# EAGLE schematic PI2GENESIS-HUB_V20170403 (EAGLE 8.2.2)
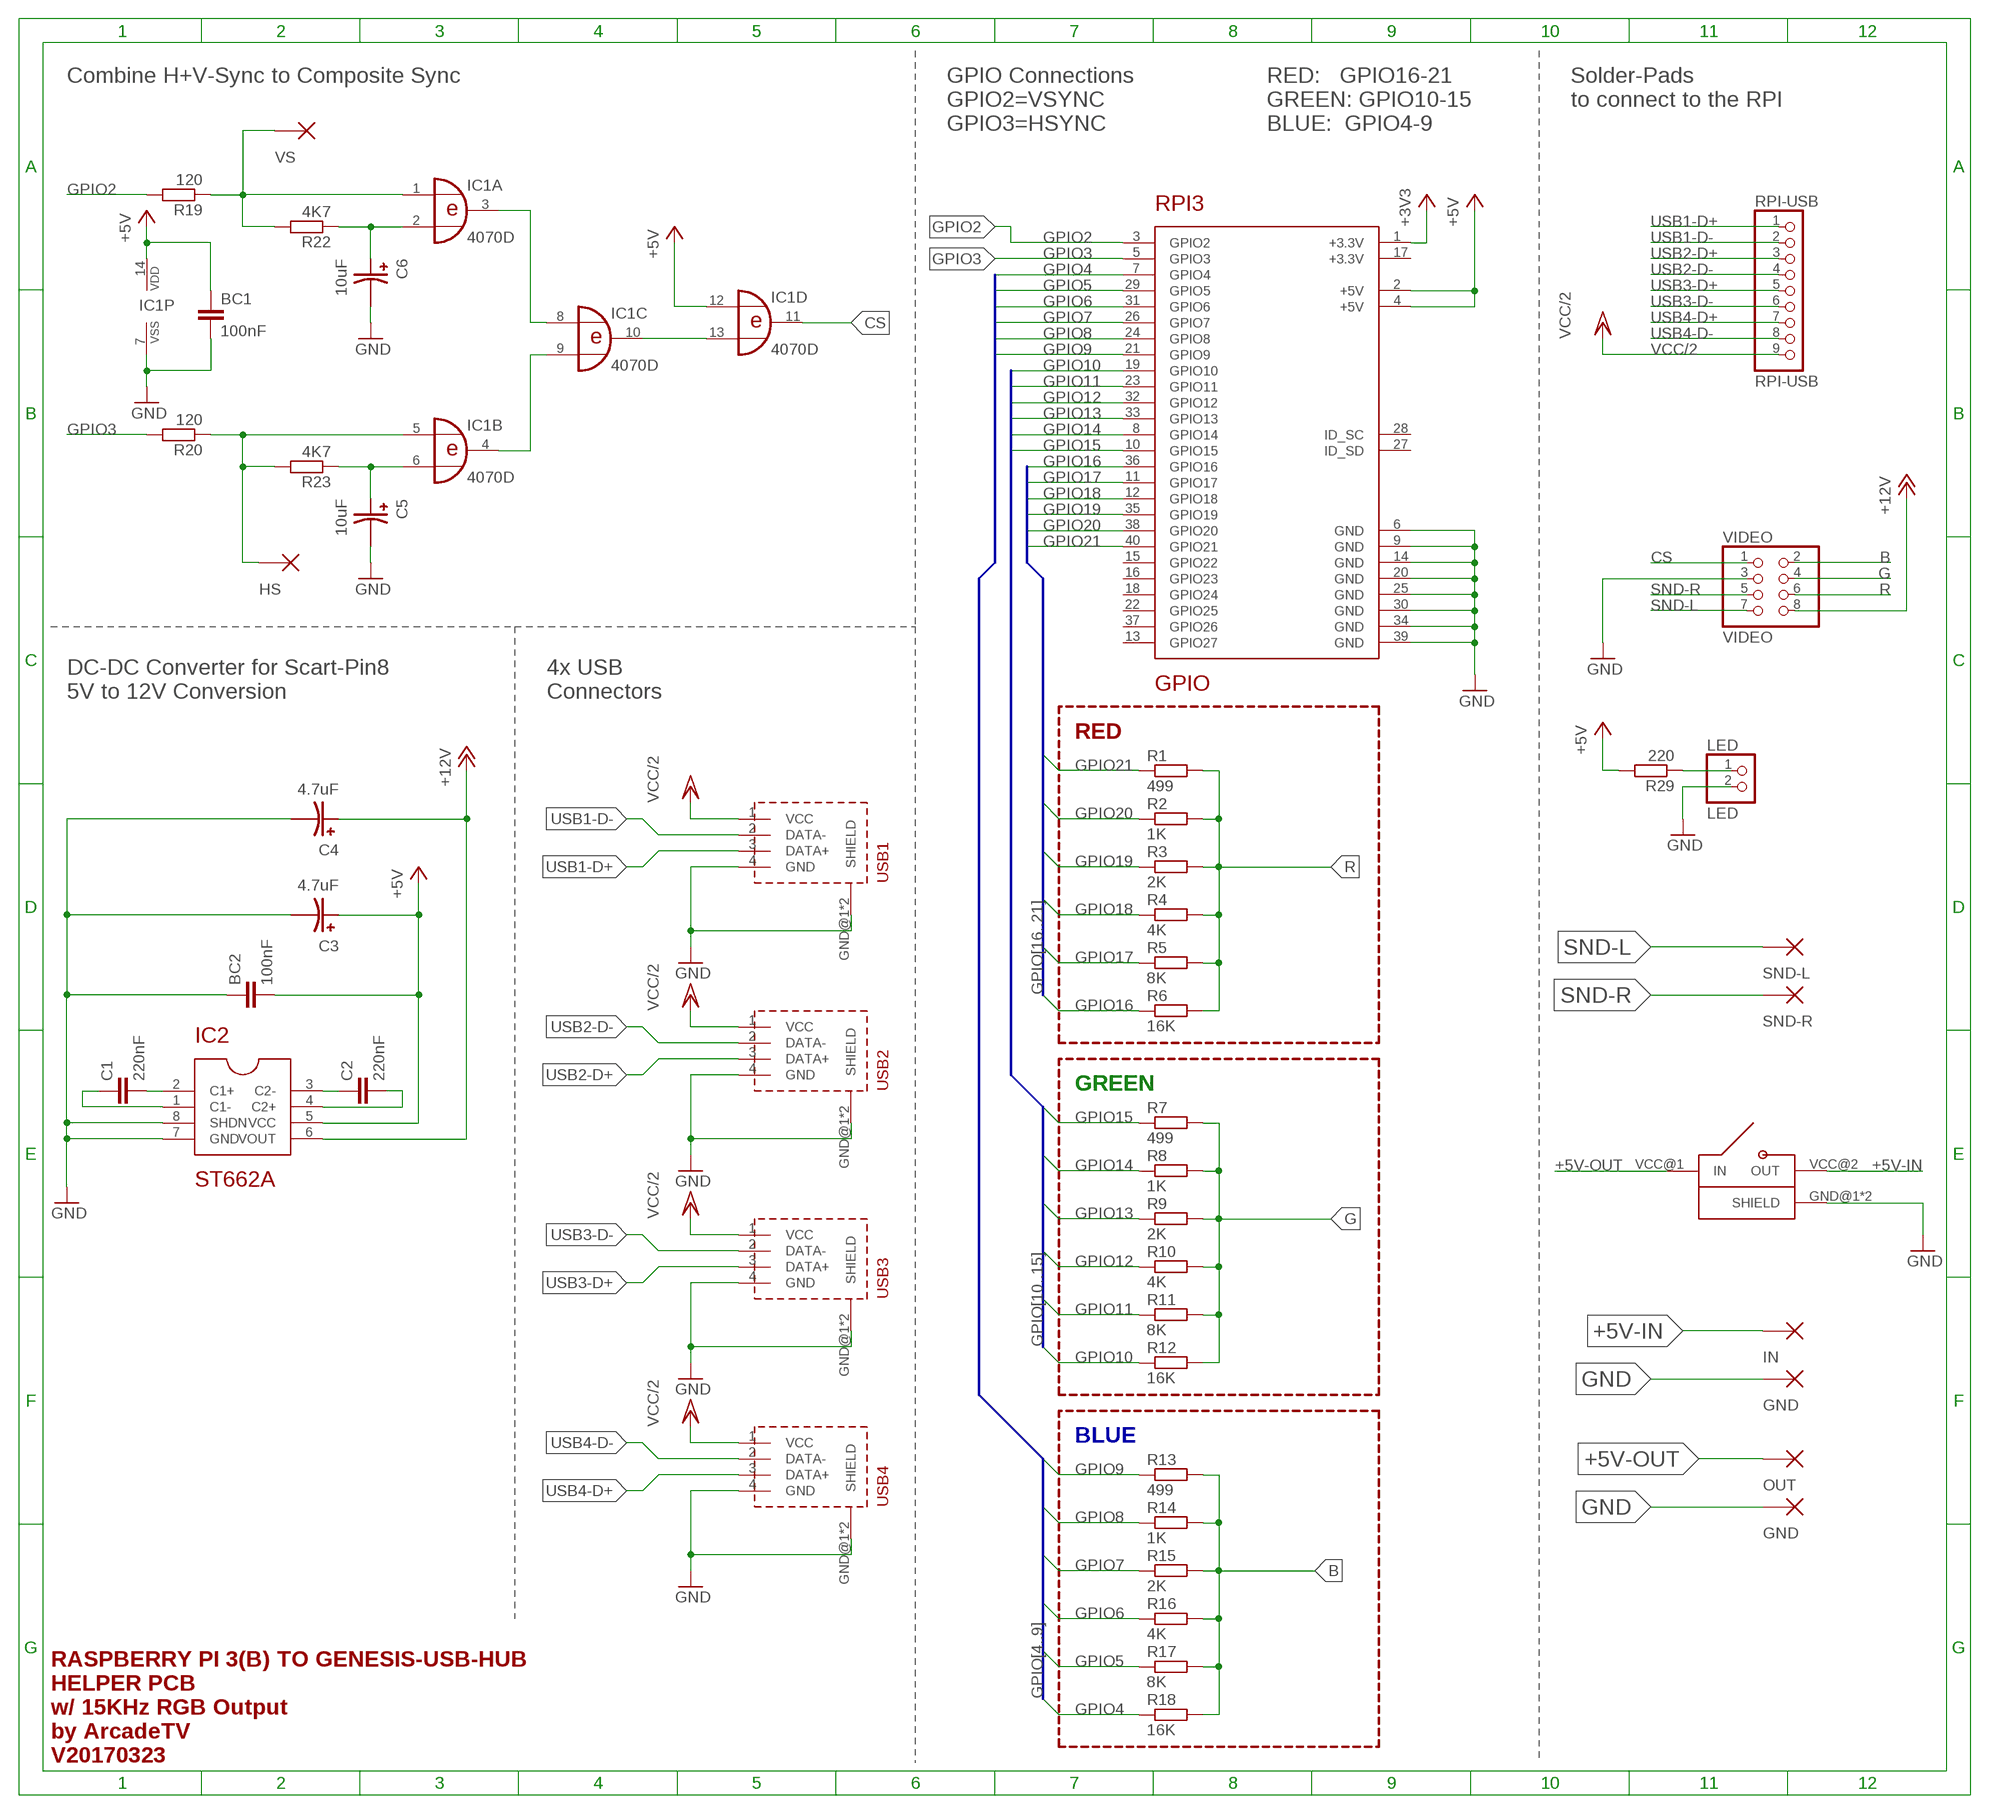
[diagram p0: schematic, sheet 1]

## Parts
BC1  100nF  C0805  [Z0805]
BC2  100nF  C0805  [Z0805]
C1  220nF  C0805  [Z0805]
C2  220nF  C0805  [Z0805]
C3  4.7uF  EEEFPJ101UAR_PANASONIC_VFP-SERIES  [EEEFPJ101UAR_PANASONIC_VFP-SERIES]
C4  4.7uF  EEEFPJ101UAR_PANASONIC_VFP-SERIES  [EEEFPJ101UAR_PANASONIC_VFP-SERIES]
C5  10uF  EEEFPJ101UAR_PANASONIC_VFP-SERIES  [EEEFPJ101UAR_PANASONIC_VFP-SERIES]
C6  10uF  EEEFPJ101UAR_PANASONIC_VFP-SERIES  [EEEFPJ101UAR_PANASONIC_VFP-SERIES]
IC1  4070D  [SO14]
IC2  ST662A  [SO-8]
LED  LED  PINHD-1X2  [1X02]
PAD1  HS  PAD  [PADS]
PAD2  VS  PAD  [PADS]
R1  499  R0805  [Z0805]
R2  1K  R0805  [Z0805]
R3  2K  R0805  [Z0805]
R4  4K  R0805  [Z0805]
R5  8K  R0805  [Z0805]
R6  16K  R0805  [Z0805]
R7  499  R0805  [Z0805]
R8  1K  R0805  [Z0805]
R9  2K  R0805  [Z0805]
R10  4K  R0805  [Z0805]
R11  8K  R0805  [Z0805]
R12  16K  R0805  [Z0805]
R13  499  R0805  [Z0805]
R14  1K  R0805  [Z0805]
R15  2K  R0805  [Z0805]
R16  4K  R0805  [Z0805]
R17  8K  R0805  [Z0805]
R18  16K  R0805  [Z0805]
R19  120  R0805  [Z0805]
R20  120  R0805  [Z0805]
R22  4K7  R0805  [Z0805]
R23  4K7  R0805  [Z0805]
R29  220  R0805  [Z0805]
RPI3  GPIO  RPI3-GPIOSTANDARD  [RPI3-GPIO]
RPI-USB  RPI-USB  PINHD-1X9  [1X09]
U$1  OUT  PAD  [PADS]
U$2  SND-L  PAD  [PADS]
U$3  SND-R  PAD  [PADS]
U$4  ALPS-SSSU011700  [ALPS-SSSU011700]
U$5  IN  PAD  [PADS]
U$6  GND  PAD  [PADS]
U$7  GND  PAD  [PADS]
USB1  USB-GENESIS-HUB  [USB-GENESIS-HUB]
USB2  USB-GENESIS-HUB  [USB-GENESIS-HUB]
USB3  USB-GENESIS-HUB  [USB-GENESIS-HUB]
USB4  USB-GENESIS-HUB  [USB-GENESIS-HUB]
VIDEO  VIDEO  PINHD-2X4  [2X04]

## Nets
+3V3: RPI3.1(+3.3V)
+5V: BC1.1 BC2.2 C3.PLUS(+) IC1.12(D:I0) IC1.14(P:VDD) IC2.5(VCC) R29.2 RPI3.2(+5V) RPI3.4(+5V)
+5V-IN: U$4.VCC@2(OUT) U$5.P$1
+5V-OUT: U$1.P$1 U$4.VCC@1(IN)
+12V: C4.PLUS(+) IC2.6(VOUT) VIDEO.8
B: R13.2 R14.2 R15.2 R16.2 R17.2 R18.2 VIDEO.2
CS: IC1.11(D:O) VIDEO.1
G: R7.2 R8.2 R9.2 R10.2 R11.2 R12.2 VIDEO.4
GND: BC1.2 BC2.1 C3.MINUS(-) C4.MINUS(-) C5.MINUS(-) C6.MINUS(-) IC1.7(P:VSS) IC2.7(GND) IC2.8(SHDN) LED.2 RPI3.6(GND) RPI3.9(GND) RPI3.14(GND) RPI3.20(GND) RPI3.25(GND) RPI3.30(GND) RPI3.34(GND) RPI3.39(GND) U$4.GND@1(SHIELD) U$4.GND@2(SHIELD) U$6.P$1 U$7.P$1 USB1.4(GND) USB1.GND@1(SHIELD) USB1.GND@2(SHIELD) USB2.4(GND) USB2.GND@1(SHIELD) USB2.GND@2(SHIELD) USB3.4(GND) USB3.GND@1(SHIELD) USB3.GND@2(SHIELD) USB4.4(GND) USB4.GND@1(SHIELD) USB4.GND@2(SHIELD) VIDEO.3
GPIO2: R19.2 RPI3.3(GPIO2)
GPIO3: R20.2 RPI3.5(GPIO3)
GPIO4: R18.1 RPI3.7(GPIO4)
GPIO5: R17.1 RPI3.29(GPIO5)
GPIO6: R16.1 RPI3.31(GPIO6)
GPIO7: R15.1 RPI3.26(GPIO7)
GPIO8: R14.1 RPI3.24(GPIO8)
GPIO9: R13.1 RPI3.21(GPIO9)
GPIO10: R12.1 RPI3.19(GPIO10)
GPIO11: R11.1 RPI3.23(GPIO11)
GPIO12: R10.1 RPI3.32(GPIO12)
GPIO13: R9.1 RPI3.33(GPIO13)
GPIO14: R8.1 RPI3.8(GPIO14)
GPIO15: R7.1 RPI3.10(GPIO15)
GPIO16: R6.1 RPI3.36(GPIO16)
GPIO17: R5.1 RPI3.11(GPIO17)
GPIO18: R4.1 RPI3.12(GPIO18)
GPIO19: R3.1 RPI3.35(GPIO19)
GPIO20: R2.1 RPI3.38(GPIO20)
GPIO21: R1.1 RPI3.40(GPIO21)
N$1: C1.2 IC2.2(C1+)
N$2: C1.1 IC2.1(C1-)
N$3: C2.1 IC2.3(C2-)
N$4: C2.2 IC2.4(C2+)
N$6: LED.1 R29.1
N$7: IC1.1(A:I0) PAD2.P$1 R19.1 R22.2
N$8: C5.PLUS(+) IC1.6(B:I1) R23.1
N$9: IC1.4(B:O) IC1.9(C:I1)
N$10: IC1.10(C:O) IC1.13(D:I1)
N$11: IC1.5(B:I0) PAD1.P$1 R20.1 R23.2
N$13: IC1.3(A:O) IC1.8(C:I0)
N$14: C6.PLUS(+) IC1.2(A:I1) R22.1
R: R1.2 R2.2 R3.2 R4.2 R5.2 R6.2 VIDEO.6
SND-L: U$2.P$1 VIDEO.7
SND-R: U$3.P$1 VIDEO.5
USB1-D+: RPI-USB.1 USB1.3(DATA+)
USB1-D-: RPI-USB.2 USB1.2(DATA-)
USB2-D+: RPI-USB.3 USB2.3(DATA+)
USB2-D-: RPI-USB.4 USB2.2(DATA-)
USB3-D+: RPI-USB.5 USB3.3(DATA+)
USB3-D-: RPI-USB.6 USB3.2(DATA-)
USB4-D+: RPI-USB.7 USB4.3(DATA+)
USB4-D-: RPI-USB.8 USB4.2(DATA-)
VCC/2: RPI-USB.9 USB1.1(VCC) USB2.1(VCC) USB3.1(VCC) USB4.1(VCC)
Unconnected: RPI3.13(GPIO27) RPI3.15(GPIO22) RPI3.16(GPIO23) RPI3.17(+3.3V) RPI3.18(GPIO24) RPI3.22(GPIO25) RPI3.27(ID_SD) RPI3.28(ID_SC) RPI3.37(GPIO26)

## Buses
GPIO[16..21]
GPIO[10..15]
GPIO[4..9]

## Notes on the sheet
- Combine H+V-Sync to Composite Sync
- GPIO Connections
  GPIO2=VSYNC
  GPIO3=HSYNC
- RED:   GPIO16-21
  GREEN: GPIO10-15
  BLUE:  GPIO4-9
- Solder-Pads
  to connect to the RPI
- DC-DC Converter for Scart-Pin8
  5V to 12V Conversion
- 4x USB
  Connectors
- RED
- GREEN
- BLUE
- RASPBERRY PI 3(B) TO GENESIS-USB-HUB
  HELPER PCB
  w/ 15KHz RGB Output
  by ArcadeTV
  V20170323

## Library data of the parts
BC1 BC2 C1 C2 = arcadetv:C0805
C3-C6 = arcadetv:EEEFPJ101UAR_PANASONIC_VFP-SERIES
IC1 = 40xx:4070: Quad 2-input XOR
IC2 = arcadetv:ST662A
LED = pinhead:PINHD-1X2: PIN HEADER
PAD1 PAD2 U$1-U$3 U$5-U$7 = arcadetv:PAD
R1-R20 R22 R23 R29 = arcadetv:R0805
RPI3 = arcadetv:RPI3-GPIO
RPI-USB = pinhead:PINHD-1X9: PIN HEADER
U$4 = arcadetv:ALPS-SSSU011700
USB1-USB4 = arcadetv:USB-GENESIS-HUB
VIDEO = pinhead:PINHD-2X4: PIN HEADER